# Altium project Hall_conn.PrjPcb
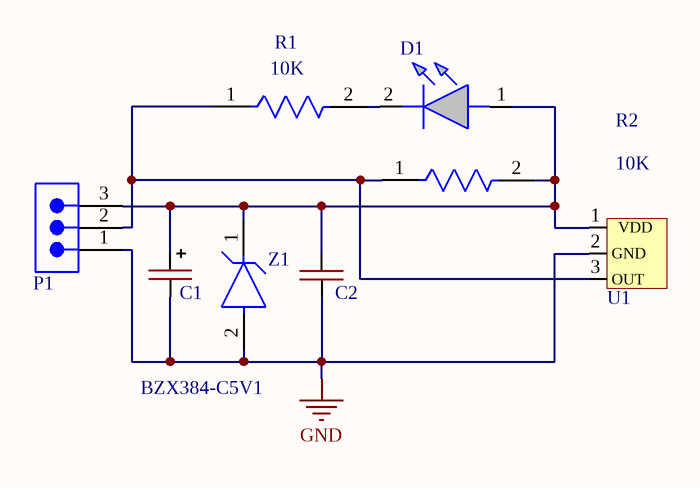
[diagram p0: Hall.SchDoc]
1 sheet, 8 parts. Net scope: global (net labels, ports and power ports of the same name join across sheets).
Board file: Hall.PcbDoc

## Sheet Hall.SchDoc
size A0; SheetNumber: 1; SheetTotal: 1

### Parts
C1  CAP-POLAR  [CAP-TAN-C]  (value not drawn)
C2  CAP-NON-POLAR  [CAP-0805]  (value not drawn)
D1  151031YS06000  [LED_RED]  (value not drawn)
P1  61900311021  [61900311021]  (value not drawn)
R1  10K  [RES-0805]
R2  10K  [RES-0805]
U1  U1881_Hall  [U1881]  (value not drawn)
Z1  BZX384-C5V1  [BZX384-SOD323-IPC_C]

### Nets
GND: C1.2(-) C2.1 P1.1 U1.2(GND) Z1.2(A)
NetC1_1: C1.1(+) C2.2 D1.1(A) P1.3 R2.2 U1.1(VDD) Z1.1(C)
NetD1_2: D1.2(K) R1.2
NetP1_2: P1.2 R1.1 R2.1 U1.3(OUT)

### Library data of the parts
D1 = LED: WURTH ELEKTRONIK - 151031YS06000 - LED, Yellow, Through Hole, T-1 (3mm), 30 mA, 2 V, 590 nm; Geometry.Height: 5.5mm; Manufacturer_Name: Wurth Elektronik; Manufacturer_Part_Number: 151031YS06000; Mouser Part Number: 710-151031YS06000; Mouser Price/Stock: https://www.mouser.co.uk/ProductDetail/Wurth-Elektronik/151031YS06000?qs=LlUlMxKIyB3xSYYW%252BcuBiQ%3D%3D; Arrow Part Number: *; Arrow Price/Stock: *; Mouser Testing Part Number: *; Mouser Testing Price/Stock: *; Datasheet Link: https://katalog.we-online.de/led/datasheet/151031YS06000.pdf
P1 = 61900311021: WR-WTB THT Male Left Angled Bottom Locking Header, pitch 2.54mm, 3pins; Manufacturer: Wurth Elektronik; Contact Resistance: 20mΩ; Rated Current: 3A; Working Voltage: 250VAC; Withstanding Voltage: 1000VAC; ComponentLink1Description: Website Link; ComponentLink1URL: https://www.we-online.com/redexpert/article/61900311021?ad; ComponentLink2Description: Datasheet Link; ComponentLink2URL: https://www.we-online.com/redexpert/spec/61900311021?ad; Manufacturer Part Number: 61900311021; Category: Wire-to-Board Connectors; Match Code: WR-WTB; Mount: Through Hole; Operating Temperature Max: 105°C; Operating Temperature Min: -40°C; Packaging: Bag; Length: 7.62mm; Width: 12.47mm; Height: 5.8mm; Gender: Male; Number of Pins: 3; Number of Rows: 1; Orientation: Right Angled Bottom Locking; Pitch: 2.54mm
R1 R2 = RES-CONST